# EAGLE design Load_Testbed_V3 (EAGLE 9.6.2)
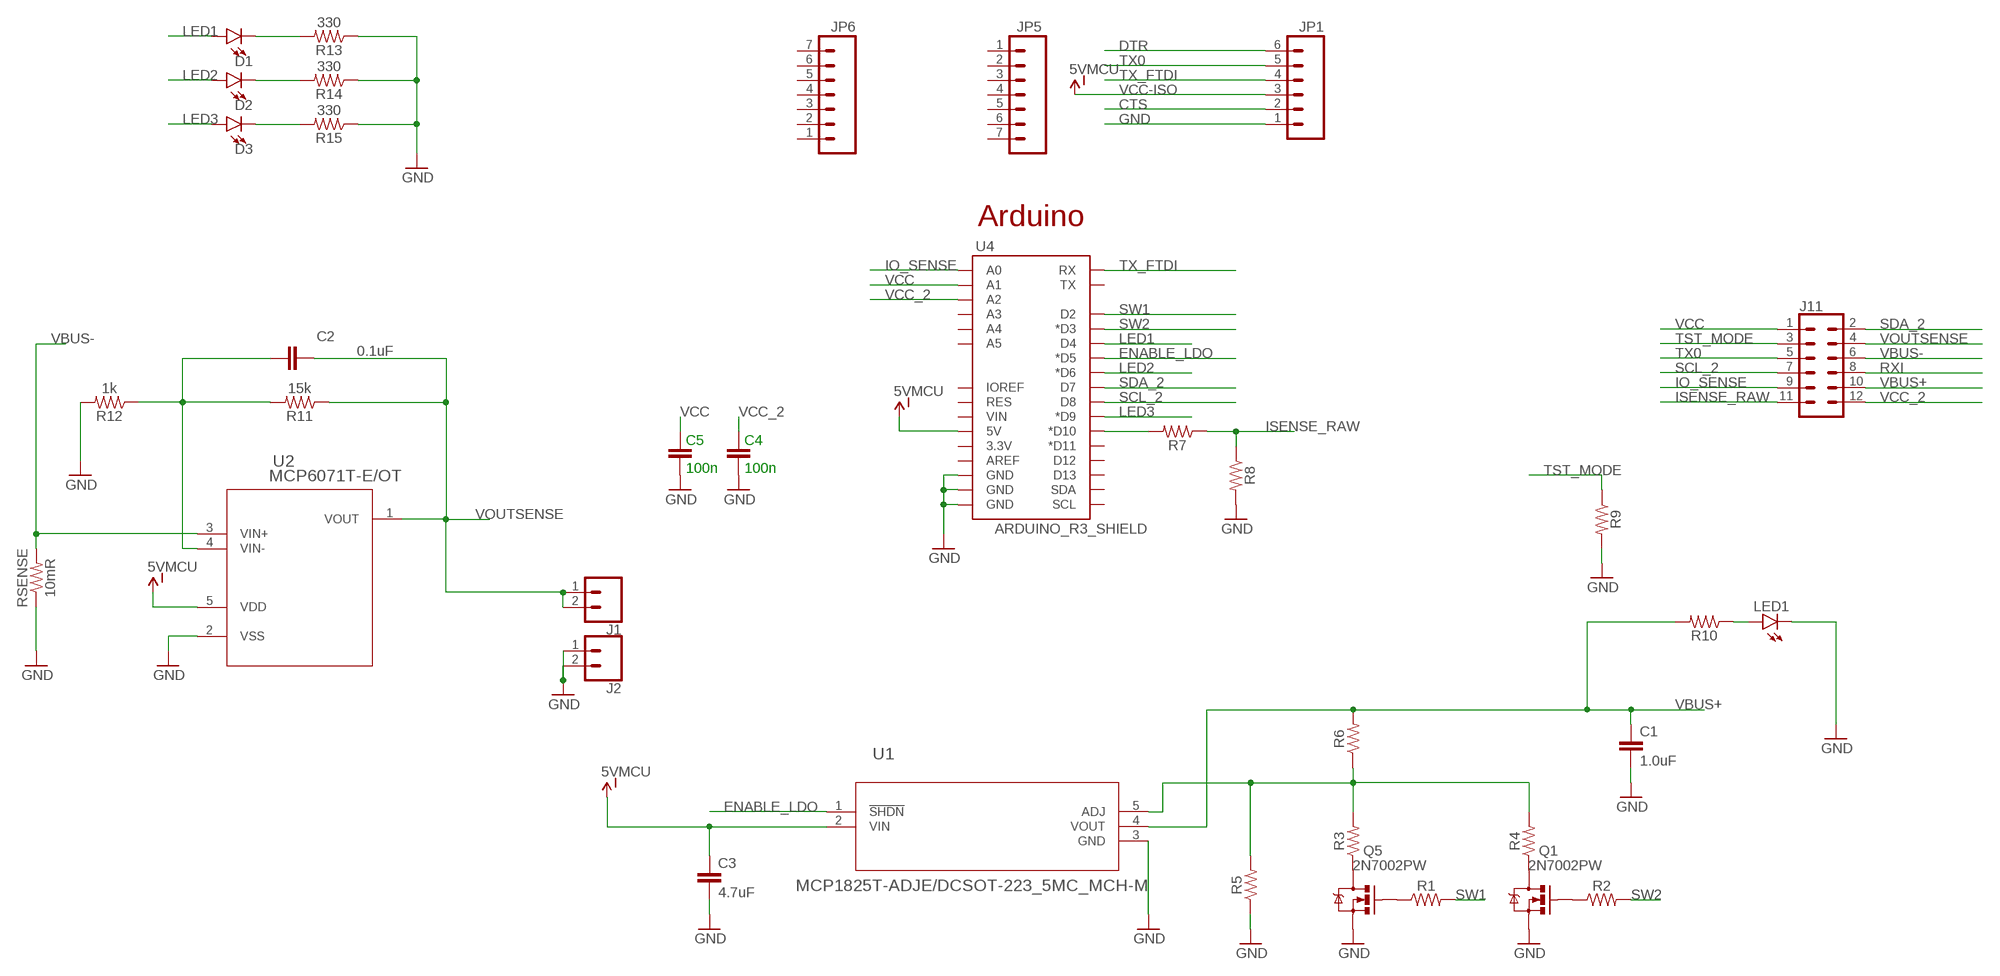
[diagram p0: schematic, sheet 1]

## Parts
C1  1.0uF  1.0UF-0805-25V-(+80/-20%)  [0805]
C2  0.1uF  0.1UF-0603-25V-(+80/-20%)  [0603]
C3  4.7uF  4.7UF0603  [0603]
C4  100n  CAP0805  [0805]
C5  100n  CAP0805  [0805]
D1  LED1206  [LED-1206]
D2  LED1206  [LED-1206]
D3  LED1206  [LED-1206]
J1  CONN_02  [1X02]
J2  CONN_02  [1X02]
J11  2X6 FEMALE  CONN_06X2PTH_FEMALE  [2X6]
JP1  M06NO_SILK_FEMALE_PTH  [1X06_NO_SILK]
JP5  M07NO_SILK  [1X07_NO_SILK]
JP6  M07NO_SILK  [1X07_NO_SILK]
LED1  LED3MM  [LED3MM]
Q1  2N7002PW  MOSFET-NCHANNEL2N7002PW  [SOT323]
Q5  2N7002PW  MOSFET-NCHANNEL2N7002PW  [SOT323]
R1  RESISTOR0805  [0805]
R2  RESISTOR0805  [0805]
R3  RESISTOR0805  [0805]
R4  RESISTOR0805  [0805]
R5  RESISTOR0805  [0805]
R6  RESISTOR0805  [0805]
R7  RESISTOR0805  [0805]
R8  RESISTOR0805  [0805]
R9  RESISTOR0805  [0805]
R10  RESISTOR0805  [0805]
R11  15k  RESISTOR0402  [0402]
R12  1k  RESISTOR0402  [0402]
R13  330  RESISTOR0805  [0805]
R14  330  RESISTOR0805  [0805]
R15  330  RESISTOR0805  [0805]
RSENSE  10mR  RESISTOR0603  [0603]
U1  MCP1825T-ADJE/DCSOT-223_5MC_MCH-M  [SOT-223_5MC_MCH-M]
U2  MCP6071T-E/OT  [SOT-23-5_MC_MCH]
U4  ARDUINO_R3_SHIELD  [UNO_R3_SHIELD]

## Nets
CTS: JP1.2
DTR: JP1.6
ENABLE_LDO: U1.1(!SHDN) U4.D5(*D5)
GND: C1.2 C3.2 C4.1 C5.1 J2.1 J2.2 JP1.1 LED1.K(C) Q1.2(S) Q5.2(S) R5.1 R8.2 R9.2 R12.2 R13.1 R14.1 R15.1 RSENSE.1 U1.3(GND) U2.2(VSS) U4.GND@0(GND) U4.GND@1(GND) U4.GND@2(GND)
IO_SENSE: J11.9 U4.A0
ISENSE_RAW: J11.11 R7.1 R8.1
LED1: D1.A U4.D4
LED2: D2.A U4.D6(*D6)
LED3: D3.A U4.D9(*D9)
N$1: C2.2 R11.2 R12.1 U2.4(VIN-)
N$2: Q5.1(G) R1.1
N$3: Q1.1(G) R2.1
N$4: Q5.3(D) R3.1
N$5: Q1.3(D) R4.1
N$6: LED1.A R10.1
N$7: R3.2 R4.2 R5.2 R6.1 U1.5(ADJ)
N$8: D1.C R13.2
N$9: D2.C R14.2
N$10: D3.C R15.2
N$12: R7.2 U4.D10(*D10)
RXI: J11.8
SCL_2: J11.7 U4.D8
SDA_2: J11.2 U4.D7
SW1: R1.2 U4.D2
SW2: R2.2 U4.D3(*D3)
TST_MODE: J11.3 R9.1
TX0: J11.5 JP1.5
TX_FTDI: JP1.4 U4.RX
VBUS+: C1.1 J11.10 R6.2 R10.2 U1.4(VOUT)
VBUS-: J11.6 RSENSE.2 U2.3(VIN+)
VCC: C5.2 J11.1 U4.A1
VCC-ISO: C3.1 JP1.3 U1.2(VIN) U2.5(VDD) U4.5V ; supply symbol labelled 5VMCU
VCC_2: C4.2 J11.12 U4.A2
VOUTSENSE: C2.1 J1.1 J1.2 J11.4 R11.1 U2.1(VOUT)
Unconnected: JP5.1 JP5.2 JP5.3 JP5.4 JP5.5 JP5.6 JP5.7 JP6.1 JP6.2 JP6.3 JP6.4 JP6.5 JP6.6 JP6.7 U4.3.3V U4.A3 U4.A4 U4.A5 U4.AREF U4.D11(*D11) U4.D12 U4.D13 U4.IOREF U4.RES U4.SCL U4.SDA U4.TX U4.VIN

## Notes on the sheet
- Arduino

## Library data of the parts
C1 = SparkFun-Capacitors:1.0UF: 1µF ceramic capacitors A capacitor is a passive two-terminal electrical component used to store electrical energy temporarily in an electric field.; PROD_ID: CAP-11625
C2 = SparkFun-Capacitors:0.1UF: 0.1µF ceramic capacitors A capacitor is a passive two-terminal electrical component used to store electrical energy temporarily in an electric field.; PROD_ID: CAP-00810
C3 = SparkFun-Capacitors:4.7UF: 4.7µF ceramic capacitors A capacitor is a passive two-terminal electrical component used to store electrical energy temporarily in an electric field.; PROD_ID: CAP-08280
C4 C5 = SparkFun:CAP: Capacitor Standard 0603 ceramic capacitor, and 0.1" leaded capacitor.
D1-D3 = SparkFun-LED:LED: LED (Generic) Standard schematic elements and footprints for 5mm, 3mm, 1206, and 0603 sized LEDs. Generic LEDs with no color specified.
J1 J2 = SparkFun-Connectors:CONN_02: Multi connection point. Often used as Generic Header-pin footprint for 0.1 inch spaced/style header connections On any of the 0.1 inch spaced packages, you can populate with these: Break Away Headers - Straight <https://www.sparkfun.com/products/116> (PRT-00116) Break Away Male Headers - Right Angle <https://www.sparkfun.com/products/553> (PRT-00553) Female Headers <https://www.sparkfun.com/products/115> (PRT-00115) Break Away Headers - Machine Pin <https://www.sparkfun.com/products/117> (PRT-00117) Break Away Female Headers - Swiss Machine Pin <https://www.sparkfun.com/products/743> (PRT-00743) For SCREWTERMINALS and SPRING TERMINALS visit here: Screw Terimnals on SparkFun.com <https://www.sparkfun.com/search/results?term=Screw+Terminals> (5mm/3.5mm/2.54mm spacing) This device is also useful as a general connection point to wire up your design to another part of your project. Our various solder wires solder well into these plated through hole pads. Hook-Up Wire - Assortment (Stranded, 22 AWG) <https://www.sparkfun.com/products/11375> (PRT-11375) Hook-Up Wire - Assortment (Solid Core, 22 AWG) <https://www.sparkfun.com/products/11367> (PRT-11367) View the entire wire category on our website here <https://www.sparkfun.com/categories/141> Special notes: Molex polarized connector foot print use with: PRT-08233 with associated crimp pins and housings. 2.54_SCREWTERM for use with PRT-10571. 3.5mm Screw Terminal footprints for PRT-08084 5mm Screw Terminal footprints for use with PRT-08432
J11 = SparkFun-Connectors:CONN_06X2: Multi connection point. Often used as Generic Header-pin footprint for 0.1 inch spaced/style header connections On any of the 0.1 inch spaced packages, you can populate with these: Break Away Headers - Straight <https://www.sparkfun.com/products/116> (PRT-00116) Break Away Male Headers - Right Angle <https://www.sparkfun.com/products/553> (PRT-00553) Female Headers <https://www.sparkfun.com/products/115> (PRT-00115) Break Away Headers - Machine Pin <https://www.sparkfun.com/products/117> (PRT-00117) Break Away Female Headers - Swiss Machine Pin <https://www.sparkfun.com/products/743> (PRT-00743); PROD_ID: CONN-12423
JP1 = SparkFun-Connectors:M06: Header 6 Standard 6-pin 0.1" header. Use with straight break away headers (SKU : PRT-00116), right angle break away headers (PRT-00553), swiss pins (PRT-00743), machine pins (PRT-00117), and female headers (PRT-00115). Molex polarized connector foot print use with SKU : PRT-08094 with associated crimp pins and housings. NOTES ON THE VARIANTS LOCK and LOCK_LONGPADS... This footprint was designed to help hold the alignment of a through-hole component (i.e. 6-pin header) while soldering it into place. You may notice that each hole has been shifted either up or down by 0.005 of an inch from it's more standard position (which is a perfectly straight line). This slight alteration caused the pins (the squares in the middle) to touch the edges of the holes. Because they are alternating, it causes a "brace" to hold the component in place. 0.005 has proven to be the perfect amount of "off-center" position when using our standard breakaway headers. Although looks a little odd when you look at the bare footprint, once you have a header in there, the alteration is very hard to notice. Also,if you push a header all the way into place, it is covered up entirely on the bottom side. This idea of altering the position of holes to aid alignment will be further integrated into the Sparkfun Library for other footprints. It can help hold any component with 3 or more connection pins.; PROD_ID: CONN-08437
JP5 JP6 = SparkFun-Connectors:M07: Header 7 Standard 7-pin 0.1" header. Use with straight break away headers (SKU : PRT-00116), right angle break away headers (PRT-00553), swiss pins (PRT-00743), machine pins (PRT-00117), and female headers (PRT-00115). NOTES ON THE VARIANTS LOCK and LOCK_LONGPADS... This footprint was designed to help hold the alignment of a through-hole component (i.e. 7-pin header) while soldering it into place. You may notice that each hole has been shifted either up or down by 0.005 of an inch from it's more standard position (which is usually a perfectly straight line). This slight alteration caused the pins (the squares in the middle) to touch the edges of the holes. Because they are alternating, it causes a "brace" to hold the header in place. 0.005 has proven to be the perfect amount of "off-center" position when using our standard breakaway headers. Although looks a little odd when you look at the bare footprint, once you have a header in there, the alteration is very hard to notice. Also, if you push a header all the way into place, it is covered up entirely on the bottom side. This idea of altering the position of holes to aid alignment will be further integrated into the Sparkfun Library for other footprints. It can help hold any component with 3 or more connection pins.
LED1 = led:LED: LED OSRAM: - CHIPLED LG R971, LG N971, LY N971, LG Q971, LY Q971, LO R971, LY R971 LH N974, LH R974 LS Q976, LO Q976, LY Q976 LO Q996 - Hyper CHIPLED LW Q18S LB Q993, LB Q99A, LB R99A - SideLED LS A670, LO A670, LY A670, LG A670, LP A670 LB A673, LV A673, LT A673, LW A673 LH A674 LY A675 LS A676, LA A676, LO A676, LY A676, LW A676 LS A679, LY A679, LG A679 - Hyper Micro SIDELED® LS Y876, LA Y876, LO Y876, LY Y876 LT Y87S - SmartLED LW L88C, LW L88S LB L89C, LB L89S, LG L890 LS L89K, LO L89K, LY L89K LS L896, LA L896, LO L896, LY L896 - TOPLED LS T670, LO T670, LY T670, LG T670, LP T670 LSG T670, LSP T670, LSY T670, LOP T670, LYG T670 LG T671, LOG T671, LSG T671 LB T673, LV T673, LT T673, LW T673 LH T674 LS T676, LA T676, LO T676, LY T676, LB T676, LH T676, LSB T676, LW T676 LB T67C, LV T67C, LT T67C, LS T67K, LO T67K, LY T67K, LW E67C LS E67B, LA E67B, LO E67B, LY E67B, LB E67C, LV E67C, LT E67C LW T67C LS T679, LY T679, LG T679 LS T770, LO T770, LY T770, LG T770, LP T770 LB T773, LV T773, LT T773, LW T773 LH T774 LS E675, LA E675, LY E675, LS T675 LS T776, LA T776, LO T776, LY T776, LB T776 LHGB T686 LT T68C, LB T68C - Hyper Mini TOPLED® LB M676 - Mini TOPLED Santana® LG M470 LS M47K, LO M47K, LY M47K Source: http://www.osram.convergy.de LUXEON: - LUMILED® LXK2-PW12-R00, LXK2-PW12-S00, LXK2-PW14-U00, LXK2-PW14-V00 LXK2-PM12-R00, LXK2-PM12-S00, LXK2-PM14-U00 LXK2-PE12-Q00, LXK2-PE12-R00, LXK2-PE12-S00, LXK2-PE14-T00, LXK2-PE14-U00 LXK2-PB12-K00, LXK2-PB12-L00, LXK2-PB12-M00, LXK2-PB14-N00, LXK2-PB14-P00, LXK2-PB14-Q00 LXK2-PR12-L00, LXK2-PR12-M00, LXK2-PR14-Q00, LXK2-PR14-R00 LXK2-PD12-Q00, LXK2-PD12-R00, LXK2-PD12-S00 LXK2-PH12-R00, LXK2-PH12-S00 LXK2-PL12-P00, LXK2-PL12-Q00, LXK2-PL12-R00 Source: www.luxeon.com KINGBRIGHT: KA-3528ASYC Source: www.kingbright.com
Q1 Q5 = SparkFun-DiscreteSemi:MOSFET-NCHANNEL: Common NMOSFET Parts MFG P/N Store ID Prod ID FDD8780 TRANS-09984 SI7820DN TRANS-11055 FDS6630A IC-08089 2N7002PW TRANS-11151 FQP30N06L COM-10213 TRANS-10060 BSS123LT1G TRANS-08345 BSS138 TRANS-00830 BS170 2N7000; PROD_ID: TRANS-11151
R1-R15 RSENSE = SparkFun-Resistors:RESISTOR: Generic Resistor Package
U1 = MCP1825T-ADJE:MCP1825T-ADJE/DC; BUILT_BY: EMA_UL_Team; MANUFACTURER_PART_NUMBER: MCP1825T-ADJE/DC; SOURCELIBRARY: Microchip_2011-05-13; VENDOR: Microchip
U2 = MCP6071:MCP6071T-E/OT; BUILT_BY: EMA_Jessica; COPYRIGHT: Copyright (C) 2018 Accelerated Designs. All rights reserved; MANUFACTURER_PART_NUMBER: MCP6071T-E/OT; SOURCELIBRARY: Microchip_2019-08-23_21; VENDOR: Microchip
U4 = SparkFun-Boards:ARDUINO_R3_SHIELD: Shield form compatible with the Arduino Uno R3.

## Board
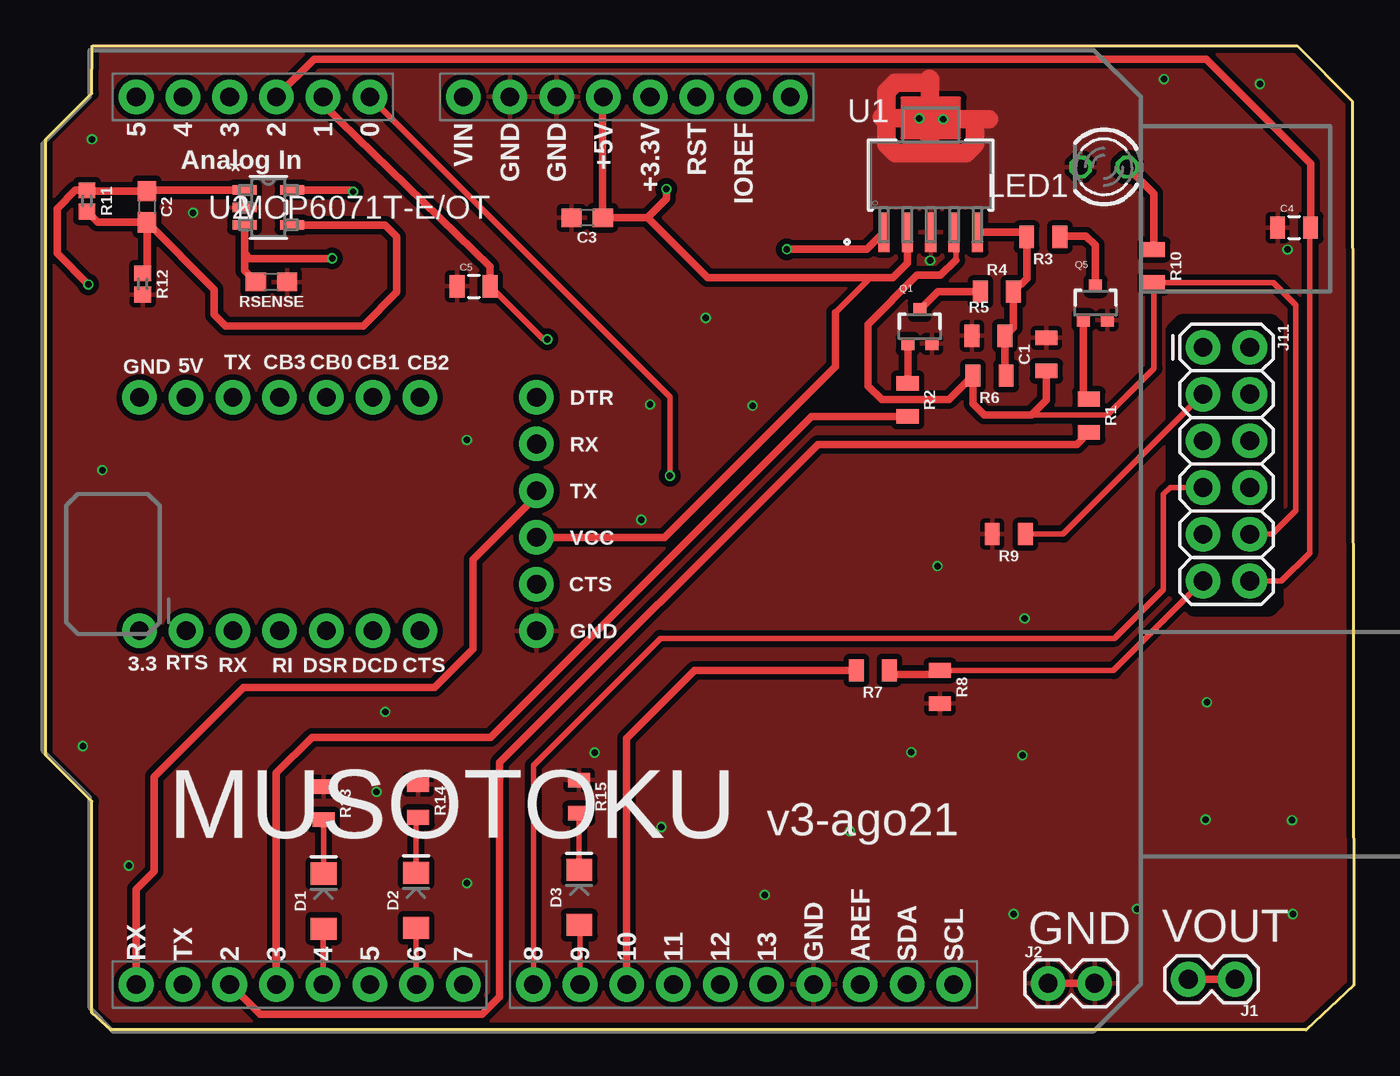
[diagram p1: board, top side]
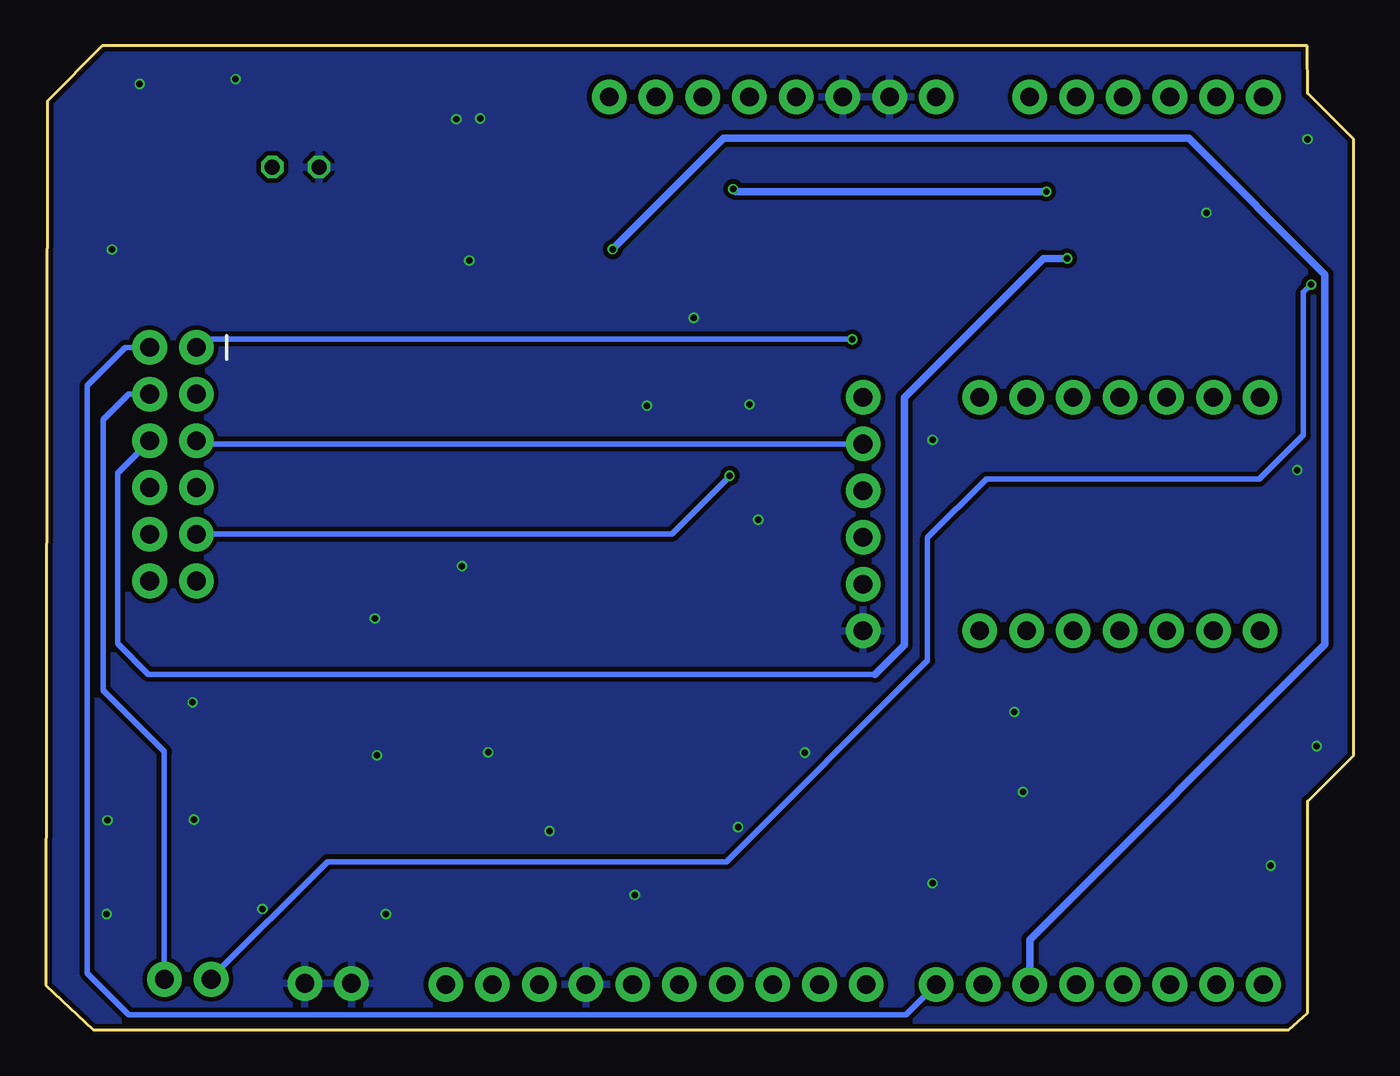
[diagram p2: board, bottom side, seen from below]

Size 71.09 x 53.5 mm. Coordinates in mm from the lower left corner, seen from the top.
Outline: 3.52,0 2.5,0.93 2.5,12.43 0,14.93 0,48.43 2.5,50.93 2.52,53.5 68.02,53.5 71.02,50.5 71.09,2.43 68.52,0 3.52,0
Copper layers (1*16): Top 0.035mm / dielectric 1.5mm / Bottom 0.035mm
Design rules "Fusion_eagle_rule_v1.1 *": minimum track width 10mil, minimum drill 0.00761875mm, track to track 10mil, track to pad 10mil, pad to pad 10mil, via to via 10mil, smd to smd 10mil, copper to edge 10mil, drill to drill 10mil, minimum pad ring 6mil, minimum via ring 4mil, stop-mask expansion 4mil, vias tented up to drill 25mil, thermal gap 10mil
tRestrict: area 61.2,22.9 to 66.9,38.5

### Footprints (pad centres in the part's own frame; a part is rotated, then mirrored left to right if it is on the bottom)
0805 = smd 0.8 x 1.2: 1 -0.9,0; 2 0.9,0
0603 = smd 1.1 x 1: 1 -0.85,0; 2 0.85,0
LED-1206 = smd 1.2 x 1.4: A -1.5,0; C 1.5,0
1X02 = drill 1.016 pad 1.88: 1 0,0; 2 2.54,0
2X6 = drill 1.016 pad 1.88: 1 0,0; 2 0,2.54; 3 2.54,0; 4 2.54,2.54; 5 5.08,0; 6 5.08,2.54; 7 7.62,0; 8 7.62,2.54; 9 10.16,0; 10 10.16,2.54; 11 12.7,0; 12 12.7,2.54
1X06_NO_SILK = drill 1.016 pad 1.88: 1 0,0; 2 2.54,0; 3 5.08,0; 4 7.62,0; 5 10.16,0; 6 12.7,0
1X07_NO_SILK = drill 1.016 pad 1.88: 1 0,0; 2 2.54,0; 3 5.08,0; 4 7.62,0; 5 10.16,0; 6 12.7,0; 7 15.24,0
LED3MM = drill 0.813 octagon: A -1.27,0; K 1.27,0
SOT323 = smd 0.7 x 0.7: 1 -0.65,-0.925; 2 0.65,-0.925; 3 0,0.925
0402 = smd 0.85 x 0.9: 1 -0.58,0; 2 0.58,0
SOT-223_5MC_MCH-M = smd 0.61 x 2.159: 1 -2.54,-3.109; 2 -1.27,-3.109; 3 0,-3.109; 4 1.27,-3.109; 5 2.54,-3.109
SOT-23-5_MC_MCH = smd 1.31 x 0.508: 1 -1.295,0.95; 2 -1.295,0; 3 -1.295,-0.95; 4 1.295,-0.95; 5 1.295,0.95
UNO_R3_SHIELD = drill 1.016 pad 1.88: 3.3V 50.8,26.67; 5V 50.8,29.21; A0 50.8,41.91; A1 50.8,44.45; A2 50.8,46.99; A3 50.8,49.53; A4 50.8,52.07; A5 50.8,54.61; AREF 2.54,15.24; D2 2.54,49.53; D3 2.54,46.99; D4 2.54,44.45; D5 2.54,41.91; D6 2.54,39.37; D7 2.54,36.83; D8 2.54,33.02; D9 2.54,30.48; D10 2.54,27.94; D11 2.54,25.4; D12 2.54,22.86; D13 2.54,20.32; GND@0 50.8,31.75; GND@1 50.8,34.29; GND@2 2.54,17.78; IOREF 50.8,21.59; NC 50.8,19.05; RES 50.8,24.13; RX 2.54,54.61; SCL 2.54,10.16; SDA 2.54,12.7; TX 2.54,52.07; VIN 50.8,36.83

### Placement (x,y rotation side)
C1  54.39,36.73 90 top
C2  5.49,44.76 270 top
C3  29.42,44.16 180 top
C4  67.86,43.63 0 top
C5  23.25,40.43 0 top
D1  15.09,7 90 top
D2  20.12,7.05 90 top
D3  28.99,7.21 90 top
J1  64.65,2.75 180 top
J2  54.48,2.53 0 top
J11  62.91,37.11 270 top
JP1  26.67,21.7 90 top
JP5  5.08,34.39 0 top
JP6  5.08,21.7 0 top
LED1  57.52,46.92 180 top
Q1  47.51,38.23 0 top
Q5  57.06,39.52 0 top
R1  56.7,33.4 270 top
R2  46.85,34.26 270 top
R3  54.22,43.12 180 top
R4  51.7,40.14 0 top
R5  51.24,37.74 0 top
R6  51.3,35.57 180 top
R7  44.96,19.55 180 top
R8  48.61,18.64 270 top
R9  52.35,26.96 180 top
R10  60.24,41.53 270 top
R11  2.23,45.07 270 top
R12  5.26,40.56 270 top
R13  15.09,12.33 270 top
R14  20.24,12.45 270 top
R15  28.98,12.68 270 top
RSENSE  12.26,40.67 180 top
U1  48.1,46.48 0 top
U2  12.09,44.72 0 top
U4  59.52,-0.07 90 top

### Tracks (layer width: path | path; a pad name or v marks a point on that pad's centre or on a via)
ENABLE_LDO  (via drill 0.35)
  Top 0.406: v40.28,42.45 44.64,42.45 U1.1
  Bottom 0.406: v40.28,42.45 34.25,48.48 8.97,48.48 1.56,41.07 1.56,20.96 17.61,4.91 U4.D5
GND  (via drill 0.35)
  Top 0.406: J2.1 J2.2
  Top 1.016: 45.51,49.56 v47.48,49.56 48.07,49.56 | 45.51,49.56 45.45,49.62 | 48.07,47.67 50.02,47.67 50.51,48.16 50.51,49.52 | 45.51,49.56 45.69,49.38 | 45.69,49.38 45.69,48.16 46.18,47.67 48.07,47.67 | 50.51,49.52 51.26,49.52 | 50.51,49.52 v48.78,49.52 48.74,49.56 48.07,49.56 | 48.07,49.56 48.07,51.68 48.04,51.71 47.84,51.51 46.18,51.51 45.69,51.02 45.69,49.38 | 48.07,49.56 48.07,47.67
  other vias: 3.06,30.44 18.44,17.29 8,44.43 2.5,48.43 60.78,51.7 66,51.43 67.5,42.43 67.75,11.4 67.79,6.3 59.32,6.58 52.61,6.3 4.5,8.93 2,15.43 48.47,25.22 47.05,15.09 53.21,22.37 33.46,11.03 39.08,7.34 43.71,10.81 63.05,11.43 53.09,14.93 63.12,17.81 35.87,38.72 38.42,33.94 32.84,34.01 32.37,27.74 22.88,32.08 48.07,41.83 17.97,12.94 29.83,15.07 22.89,7.97
  pour Top (isolate 0.305, rank 2): -2.26,55.35 -2.26,-2.07 71.85,-2.07 71.85,55.35
  pour Bottom (isolate 0.254): -2.34,55.43 -2.34,2.27 2,-2.07 68,-2.07 71.7,1.63 71.7,51.1 67.37,55.43
IO_SENSE  (via drill 0.35)
  Top 0.305: v33.92,30.13 33.92,34.42 U4.A0
  Bottom 0.305: J11.9 37.05,26.95 33.92,30.08 v33.92,30.13
ISENSE_RAW
  Top 0.305: J11.11 58.04,19.54 R8.1
  Top 0.406: R7.1 46.08,19.33 48.4,19.33 R8.1
LED1
  Top 0.305: U4.D4 15.07,5.48 D1.A
LED2
  Top 0.305: D2.A 20.12,2.5 U4.D6
LED3
  Top 0.305: D3.A 29.04,5.66 U4.D9
N$1
  Top 0.406: R11.2 2.81,43.91 C2.2 | C2.2 5.49,41.37 R12.1 | C2.2 9.15,40.25 9.15,38.89 9.76,38.28 17.23,38.28 19.07,40.12 19.07,43.14 18.44,43.77 U2.4
N$2
  Top 0.406: Q5.1 56.41,34.59 R1.1
N$3
  Top 0.406: Q1.1 R2.1
N$4
  Top 0.406: Q5.3 57.06,42.66 56.55,43.17 55.17,43.17 R3.1
N$5
  Top 0.406: R4.1 48.5,40.14 Q1.3
N$6
  Top 0.406: LED1.A 60.24,45.47 R10.1
N$7
  Top 0.406: U1.5 53.07,43.37 R3.2 53.32,40.86 R4.2 52.6,38.2 R5.2 52.14,35.63 R6.1
N$8
  Top 0.305: D1.C R13.2
N$9
  Top 0.305: D2.C 20.12,11.43 R14.2
N$10
  Top 0.305: D3.C R15.2
N$12
  Top 0.406: R7.2 35.27,19.55 31.58,15.86 U4.D10
SCL_2
  Top 0.305: U4.D8 26.5,14.38 33.41,21.29 58.1,21.29 60.76,23.95 60.76,29.13 61.12,29.49 J11.7
SDA_2
  Bottom 0.305: U4.D7 24.33,0.82 66.59,0.82 68.86,3.09 68.86,35.04 66.79,37.11 J11.2
SW1
  Top 0.406: R1.2 56.04,31.84 41.97,31.84 24.67,14.54 24.67,1.81 23.7,0.84 11.65,0.84 10.02,2.47 U4.D2
SW2
  Top 0.406: R2.2 41.63,33.36 24.18,15.91 14.47,15.91 12.53,13.97 U4.D3
TST_MODE
  Top 0.305: J11.3 55.3,26.96 R9.1
TX0
  Bottom 0.305: JP1.5 62.74,31.86 J11.5
TX_FTDI
  Top 0.406: U4.RX 4.91,7.64 5.88,8.61 5.88,13.76 10.75,18.63 21.13,18.63 23.22,20.72 23.22,25.58 26.67,29.03 JP1.4
VBUS+
  Top 0.305: 53.58,33.43 57.71,33.43 60.24,35.96 R10.2 66.73,40.63 67.96,39.4 67.96,28.23 66.68,26.95 J11.10 | 49.47,41.86 49.47,43.27 U1.4
  Top 0.406: 49.47,41.86 48.64,41.03 47.36,41.03 44.69,38.36 44.69,35.02 45.45,34.26 49.09,34.26 R6.2 50.4,34.06 51.03,33.43 53.58,33.43 54.39,34.24 C1.1
VBUS-  (via drill 0.35)
  Top 0.406: RSENSE.2 10.8,41.28 10.8,42.23 | 10.8,42.23 U2.3 | v15.56,41.95 11.07,41.95 10.8,42.23
  Bottom 0.305: 26.01,19.34 65.53,19.34 67.19,21 67.19,30.29 J11.6
  Bottom 0.406: 26.01,19.34 24.43,20.92 24.43,34.39 16.87,41.95 v15.56,41.95
VCC  (via drill 0.35)
  Top 0.305: v27.26,37.55 27.03,37.55 C5.2
  Top 0.406: U4.A1 15.07,50.32 24.15,41.52 C5.2
  Bottom 0.305: v27.26,37.55 62.47,37.55 J11.1
VCC-ISO  (via drill 0.35)
  Top 0.305: 44.78,40.91 44.78,40.85 42.92,38.99
  Top 0.406: U1.2 46.83,41.7 46.04,40.91 44.78,40.91 35.95,40.91 32.7,44.16 | U4.5V 30.27,50.69 C3.1 32.7,44.16 | 42.92,38.99 42.92,36.06 33.64,26.78 JP1.3 | U2.5 16.61,45.67 v16.7,45.58 | v33.73,45.72 33.73,45.19 32.7,44.16
  Bottom 0.406: v16.7,45.58 33.59,45.58 v33.73,45.72
VCC_2
  Top 0.305: J11.12 67.17,24.41 68.7,25.94 68.7,43.57 C4.2
  Top 0.406: U4.A2 14.58,52.78 63.09,52.78 68.76,47.11 C4.2
VOUTSENSE  (via drill 0.35)
  Top 0.406: U2.1 5.55,45.67 C2.1 2.27,45.61 R11.1 1.6,45.65 0.6,44.65 0.6,42.23 v2.3,40.53 | J1.1 J1.2
  Bottom 0.305: v2.3,40.53 2.72,40.11 2.72,32.34 5.11,29.95 19.97,29.95 23.16,26.76 23.16,20.08 34.09,9.15 55.78,9.15 62.11,2.82 J1.2 | J1.1 64.65,15.13 67.97,18.45 67.97,33.19 66.59,34.57 J11.4

### Text on the board
tPlace: GND | 5V | TX | CB3 | CB0 | CB1 | CB2 | DTR | RX | TX | VCC | CTS | GND | 3.3 | RTS | RX | RI | DSR | DCD | CTS
tNames: v3-ago21 | MUSOTOKU | GND | VOUT